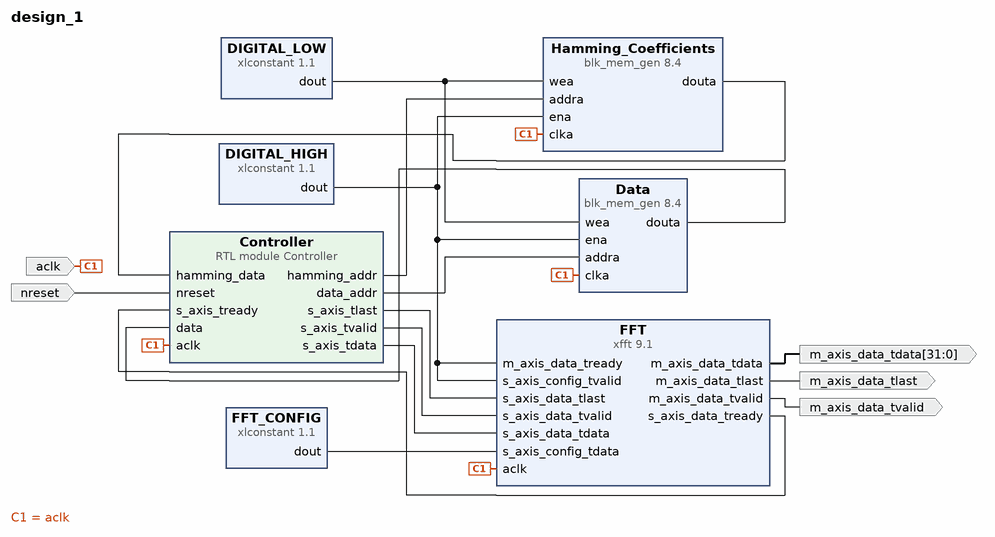
[diagram p0: block diagram of the top level]
# Vivado block design design_1, xc7z020clg484-1, Vivado 2020.2
create_bd_design design_1

create_bd_port -dir I -type clk aclk
create_bd_port -dir O m_axis_data_tlast
create_bd_port -dir O -from 31 -to 0 m_axis_data_tdata
create_bd_port -dir O m_axis_data_tvalid
create_bd_port -dir I nreset

create_bd_cell -type ip -vlnv xilinx.com:ip:blk_mem_gen:8.4 Data
set_property -dict [list \
  CONFIG.Coe_File ../../../../../../ExternalFiles/data.coe \
  CONFIG.Enable_32bit_Address false \
  CONFIG.Load_Init_File true \
  CONFIG.Operating_Mode_A READ_FIRST \
  CONFIG.Register_PortA_Output_of_Memory_Primitives true \
  CONFIG.Use_Byte_Write_Enable false \
  CONFIG.Use_RSTA_Pin false \
  CONFIG.Write_Depth_A 12520 \
  CONFIG.use_bram_block Stand_Alone \
] [get_bd_cells Data]
create_bd_cell -type ip -vlnv xilinx.com:ip:xlconstant:1.1 DIGITAL_LOW
set_property -dict {CONFIG.CONST_VAL 0} [get_bd_cells DIGITAL_LOW]
create_bd_cell -type ip -vlnv xilinx.com:ip:xlconstant:1.1 DIGITAL_HIGH
set_property -dict {CONFIG.CONST_VAL 1} [get_bd_cells DIGITAL_HIGH]
create_bd_cell -type ip -vlnv xilinx.com:ip:blk_mem_gen:8.4 Hamming_Coefficients
set_property -dict [list \
  CONFIG.Coe_File ../../../../../../ExternalFiles/hamming.coe \
  CONFIG.Enable_32bit_Address false \
  CONFIG.Load_Init_File true \
  CONFIG.Operating_Mode_A READ_FIRST \
  CONFIG.Read_Width_A 16 \
  CONFIG.Register_PortA_Output_of_Memory_Primitives true \
  CONFIG.Use_Byte_Write_Enable false \
  CONFIG.Use_RSTA_Pin false \
  CONFIG.Write_Depth_A 40 \
  CONFIG.Write_Width_A 16 \
  CONFIG.use_bram_block Stand_Alone \
] [get_bd_cells Hamming_Coefficients]
create_bd_cell -type ip -vlnv xilinx.com:ip:xfft:9.1 FFT
set_property -dict [list \
  CONFIG.implementation_options pipelined_streaming_io \
  CONFIG.number_of_stages_using_block_ram_for_data_and_phase_factors 0 \
  CONFIG.output_ordering natural_order \
  CONFIG.transform_length 32 \
] [get_bd_cells FFT]
create_bd_cell -type ip -vlnv xilinx.com:ip:xlconstant:1.1 FFT_CONFIG
set_property -dict {CONFIG.CONST_VAL b00000001 CONFIG.CONST_WIDTH 8} [get_bd_cells FFT_CONFIG]
create_bd_cell -type module -reference Controller Controller

# ---- connections ----

connect_bd_net -net xlconstant_0_dout [get_bd_pins DIGITAL_LOW/dout] [get_bd_pins Data/wea] [get_bd_pins Hamming_Coefficients/wea]
connect_bd_net -net clka_0_1 [get_bd_ports aclk] \
  [get_bd_pins Data/clka] [get_bd_pins Hamming_Coefficients/clka] [get_bd_pins FFT/aclk] [get_bd_pins Controller/aclk]
connect_bd_net [get_bd_pins DIGITAL_HIGH/dout] \
  [get_bd_pins Data/ena] [get_bd_pins Hamming_Coefficients/ena] [get_bd_pins FFT/s_axis_config_tvalid] \
  [get_bd_pins FFT/m_axis_data_tready]
connect_bd_net [get_bd_pins FFT_CONFIG/dout] [get_bd_pins FFT/s_axis_config_tdata]
connect_bd_net -net xfft_0_m_axis_data_tlast [get_bd_pins FFT/m_axis_data_tlast] [get_bd_ports m_axis_data_tlast]
connect_bd_net -net xfft_0_m_axis_data_tdata [get_bd_pins FFT/m_axis_data_tdata] [get_bd_ports m_axis_data_tdata]
connect_bd_net -net xfft_0_m_axis_data_tvalid [get_bd_pins FFT/m_axis_data_tvalid] [get_bd_ports m_axis_data_tvalid]
connect_bd_net [get_bd_pins Controller/s_axis_tlast] [get_bd_pins FFT/s_axis_data_tlast]
connect_bd_net [get_bd_pins Controller/s_axis_tvalid] [get_bd_pins FFT/s_axis_data_tvalid]
connect_bd_net -net xfft_0_s_axis_data_tready [get_bd_pins FFT/s_axis_data_tready] [get_bd_pins Controller/s_axis_tready]
connect_bd_net [get_bd_pins Controller/hamming_addr] [get_bd_pins Hamming_Coefficients/addra]
connect_bd_net [get_bd_pins Controller/data_addr] [get_bd_pins Data/addra]
connect_bd_net [get_bd_pins Data/douta] [get_bd_pins Controller/data]
connect_bd_net [get_bd_pins Hamming_Coefficients/douta] [get_bd_pins Controller/hamming_data]
connect_bd_net -net nreset_0_1 [get_bd_ports nreset] [get_bd_pins Controller/nreset]
connect_bd_net [get_bd_pins Controller/s_axis_tdata] [get_bd_pins FFT/s_axis_data_tdata]

validate_bd_design
save_bd_design
